# EAGLE design SLS schematic (EAGLE 7.6.0)
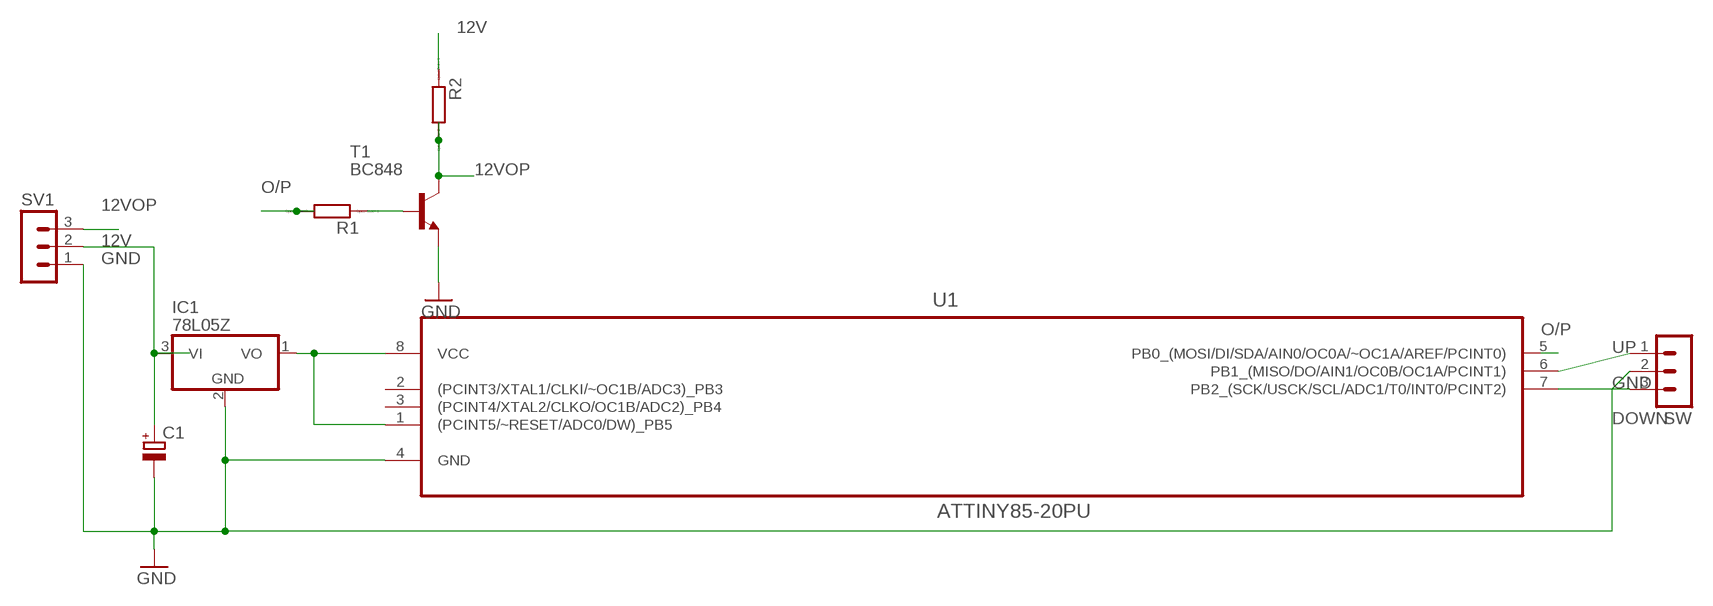
[diagram p0: schematic, sheet 1]

## Parts
C1  CPOL-EUCT3216  [CT3216]
IC1  78L05Z  [TO92]
R1  R-EU_R0805  [R0805]
R2  R-EU_R0805  [R0805]
SV1  MA03-1  [MA03-1]
SW  MA03-1  [MA03-1]
T1  BC848  [SOT23]
U1  ATTINY85-20PU  [DIP254P762X533-8]

## Nets
12V: C1.+ IC1.3(VI) R2.1 SV1.2
12VOP: R2.2 SV1.3 T1.3(C)
DOWN: SW.3 U1.7(PB2_(SCK/USCK/SCL/ADC1/T0/INT0/PCINT2))
GND: C1.- IC1.2(GND) SV1.1 SW.2 T1.2(E) U1.4(GND)
N$1: IC1.1(VO) U1.1((PCINT5/~RESET/ADC0/DW)_PB5) U1.8(VCC)
N$2: R1.1 T1.1(B)
O/P: R1.2 U1.5(PB0_(MOSI/DI/SDA/AIN0/OC0A/~OC1A/AREF/PCINT0))
UP: SW.1 U1.6(PB1_(MISO/DO/AIN1/OC0B/OC1A/PCINT1))
Unconnected: U1.2((PCINT3/XTAL1/CLKI/~OC1B/ADC3)_PB3) U1.3((PCINT4/XTAL2/CLKO/OC1B/ADC2)_PB4)

## Library data of the parts
C1 = resistor:CPOL-EU: POLARIZED CAPACITOR, European symbol
IC1 = linear:78*: Positive VOLTAGE REGULATOR Source: http://cache.national.com/ds/LM/LM78L05.pdf http://www.fairchildsemi.com/ds/LM/LM7805.pdf
R1 R2 = resistor:R-EU_: RESISTOR, European symbol; SPICEPREFIX: R
SV1 SW = con-lstb:MA03-1: PIN HEADER; OC_FARNELL: unknown; OC_NEWARK: unknown
T1 = transistor:BC848: NPN TRANSISTOR
U1 = Atmel_By_element14_Batch_1-00:ATTINY85-20PU: 8-bit Microcontroller with In-System Programmable Flash; MPN: ATTINY85-20PU; OC_FARNELL: 1455162; OC_NEWARK: 58M3796; PACKAGE: PDIP-8; SUPPLIER: Atmel

## Board
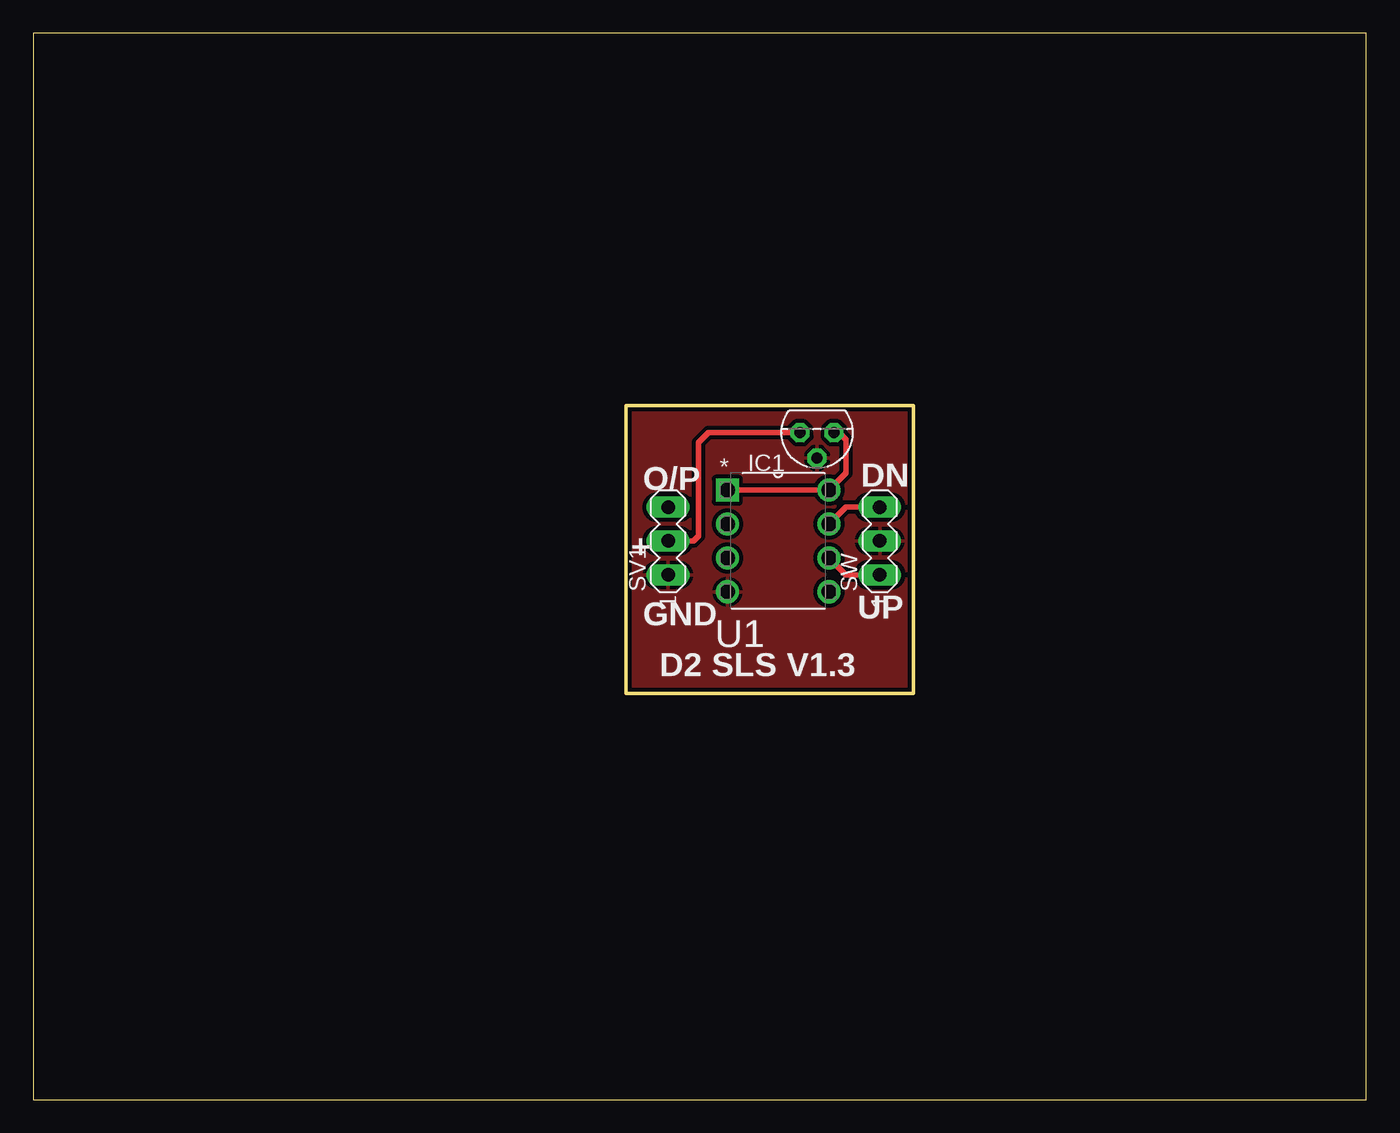
[diagram p1: board, top side]
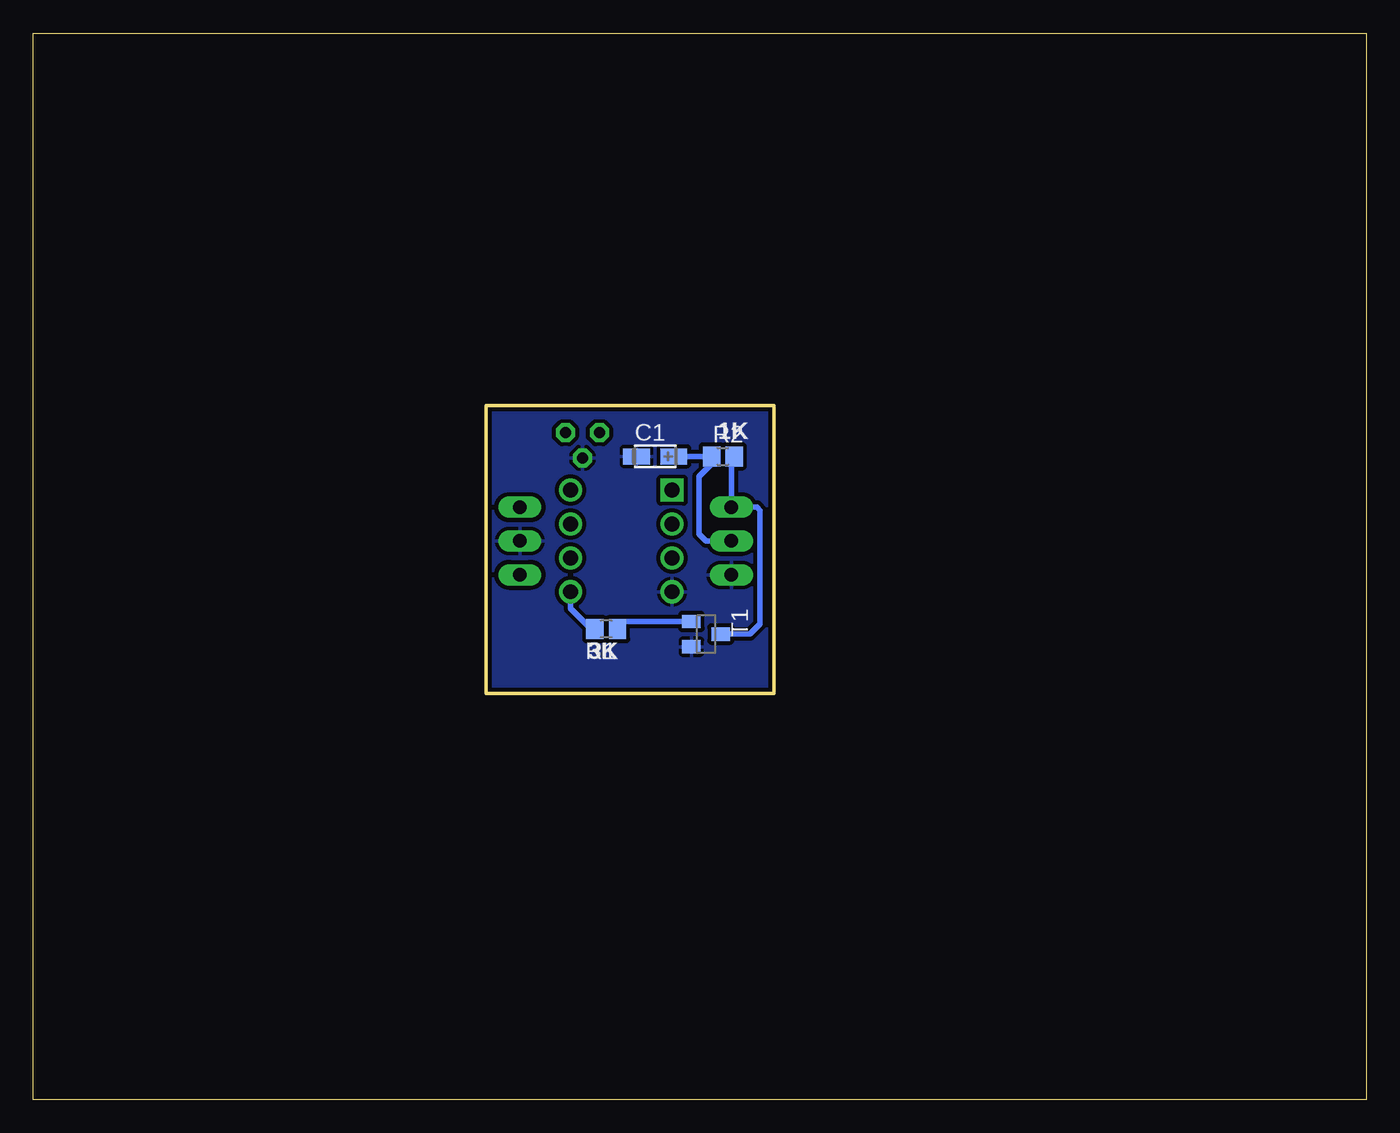
[diagram p2: board, bottom side, seen from below]

Size 100 x 80 mm. Coordinates in mm from the lower left corner, seen from the top.
Outline: 0,0 100,0 100,80 0,80 0,0
Outline: 44.45,52.07 44.45,30.48 66.04,30.48 66.04,52.07 44.45,52.07
Copper layers (1*16): Top 0.035mm / dielectric 1.5mm / Bottom 0.035mm
Design rules "SparkFun": minimum track width 8mil, minimum drill 20mil, track to track 8mil, track to pad 8mil, pad to pad 8mil, via to via 8mil, smd to smd 8mil, copper to edge 10mil, drill to drill 8mil, minimum pad ring 12mil, minimum via ring 10mil, stop-mask expansion 4mil, vias tented up to drill 25mil, thermal gap 10mil

### Footprints (pad centres in the part's own frame; a part is rotated, then mirrored left to right if it is on the bottom)
CT3216 = smd 2 x 1.2: + 1.4,0; - -1.4,0
TO92 = drill 0.813 octagon: 1 -1.27,0; 2 0,1.905; 3 1.27,0
R0805 = smd 1.3 x 1.5: 1 -0.85,0; 2 0.85,0
MA03-1 = drill 1.016 long: 1 -2.54,0; 2 0,0; 3 2.54,0
SOT23 = smd 1 x 1.4: 1 -0.95,-1.1; 2 0.95,-1.1; 3 0,1.1
DIP254P762X533-8 = drill 1.118 square: 1 -7.62,7.62 | drill 1.118: 2 -7.62,5.08; 3 -7.62,2.54; 4 -7.62,0; 5 0,0; 6 0,2.54; 7 0,5.08; 8 0,7.62

### Placement (x,y rotation side)
C1  53.34,48.26 0 bottom
IC1  58.8,50.04 180 top
R1  57.02,35.31 180 bottom
R2  48.26,48.26 0 bottom
SV1  47.62,41.91 90 top
SW  63.5,41.91 90 top
T1  49.53,34.92 270 bottom
U1  59.69,38.1 0 top

### Tracks (layer width: path | path; a pad name or v marks a point on that pad's centre or on a via)
12V
  Top 0.406: IC1.3 50.67,50.04 49.91,49.28 49.91,42.29 49.53,41.91 SV1.2
  Bottom 0.406: C1.+ R2.1 49.11,47.66 50.04,46.74 50.04,42.42 49.53,41.91 SV1.2
12VOP
  Bottom 0.406: R2.2 47.62,48.05 SV1.3 45.72,44.45 45.47,44.2 45.47,35.69 46.23,34.92 T1.3
DOWN
  Top 0.406: SW.3 60.96,44.45 U1.7
GND
  pour Top (isolate 0.305): 44.45,52.07 66.04,52.07 66.04,30.48 44.45,30.48
  pour Bottom (isolate 0.305): 44.45,52.07 66.04,52.07 66.04,50.8 66.04,30.48 44.45,30.48
N$1
  Top 0.406: U1.1 U1.8 60.96,46.99 60.96,49.53 60.45,50.04 IC1.1
N$2
  Bottom 0.406: T1.1 55.6,35.88 R1.1
O/P
  Bottom 0.406: R1.2 58.17,35.31 59.69,36.83 U1.5
UP
  Top 0.406: U1.6 60.96,39.37 SW.1

### Text on the board
tPlace: O/P | DN | + | UP | GND | D2 SLS V1.3
bPlace: 1K | 3K